# Altium schematic sheet blackbox_sch.SchDoc
size A3; Organization: Altium Limited; Address1: L3, 12a Rodborough Rd; Address2: Frenchs Forest; Address3: NSW; Address4: Australia 2086; SheetNumber: 1; SheetTotal: 4
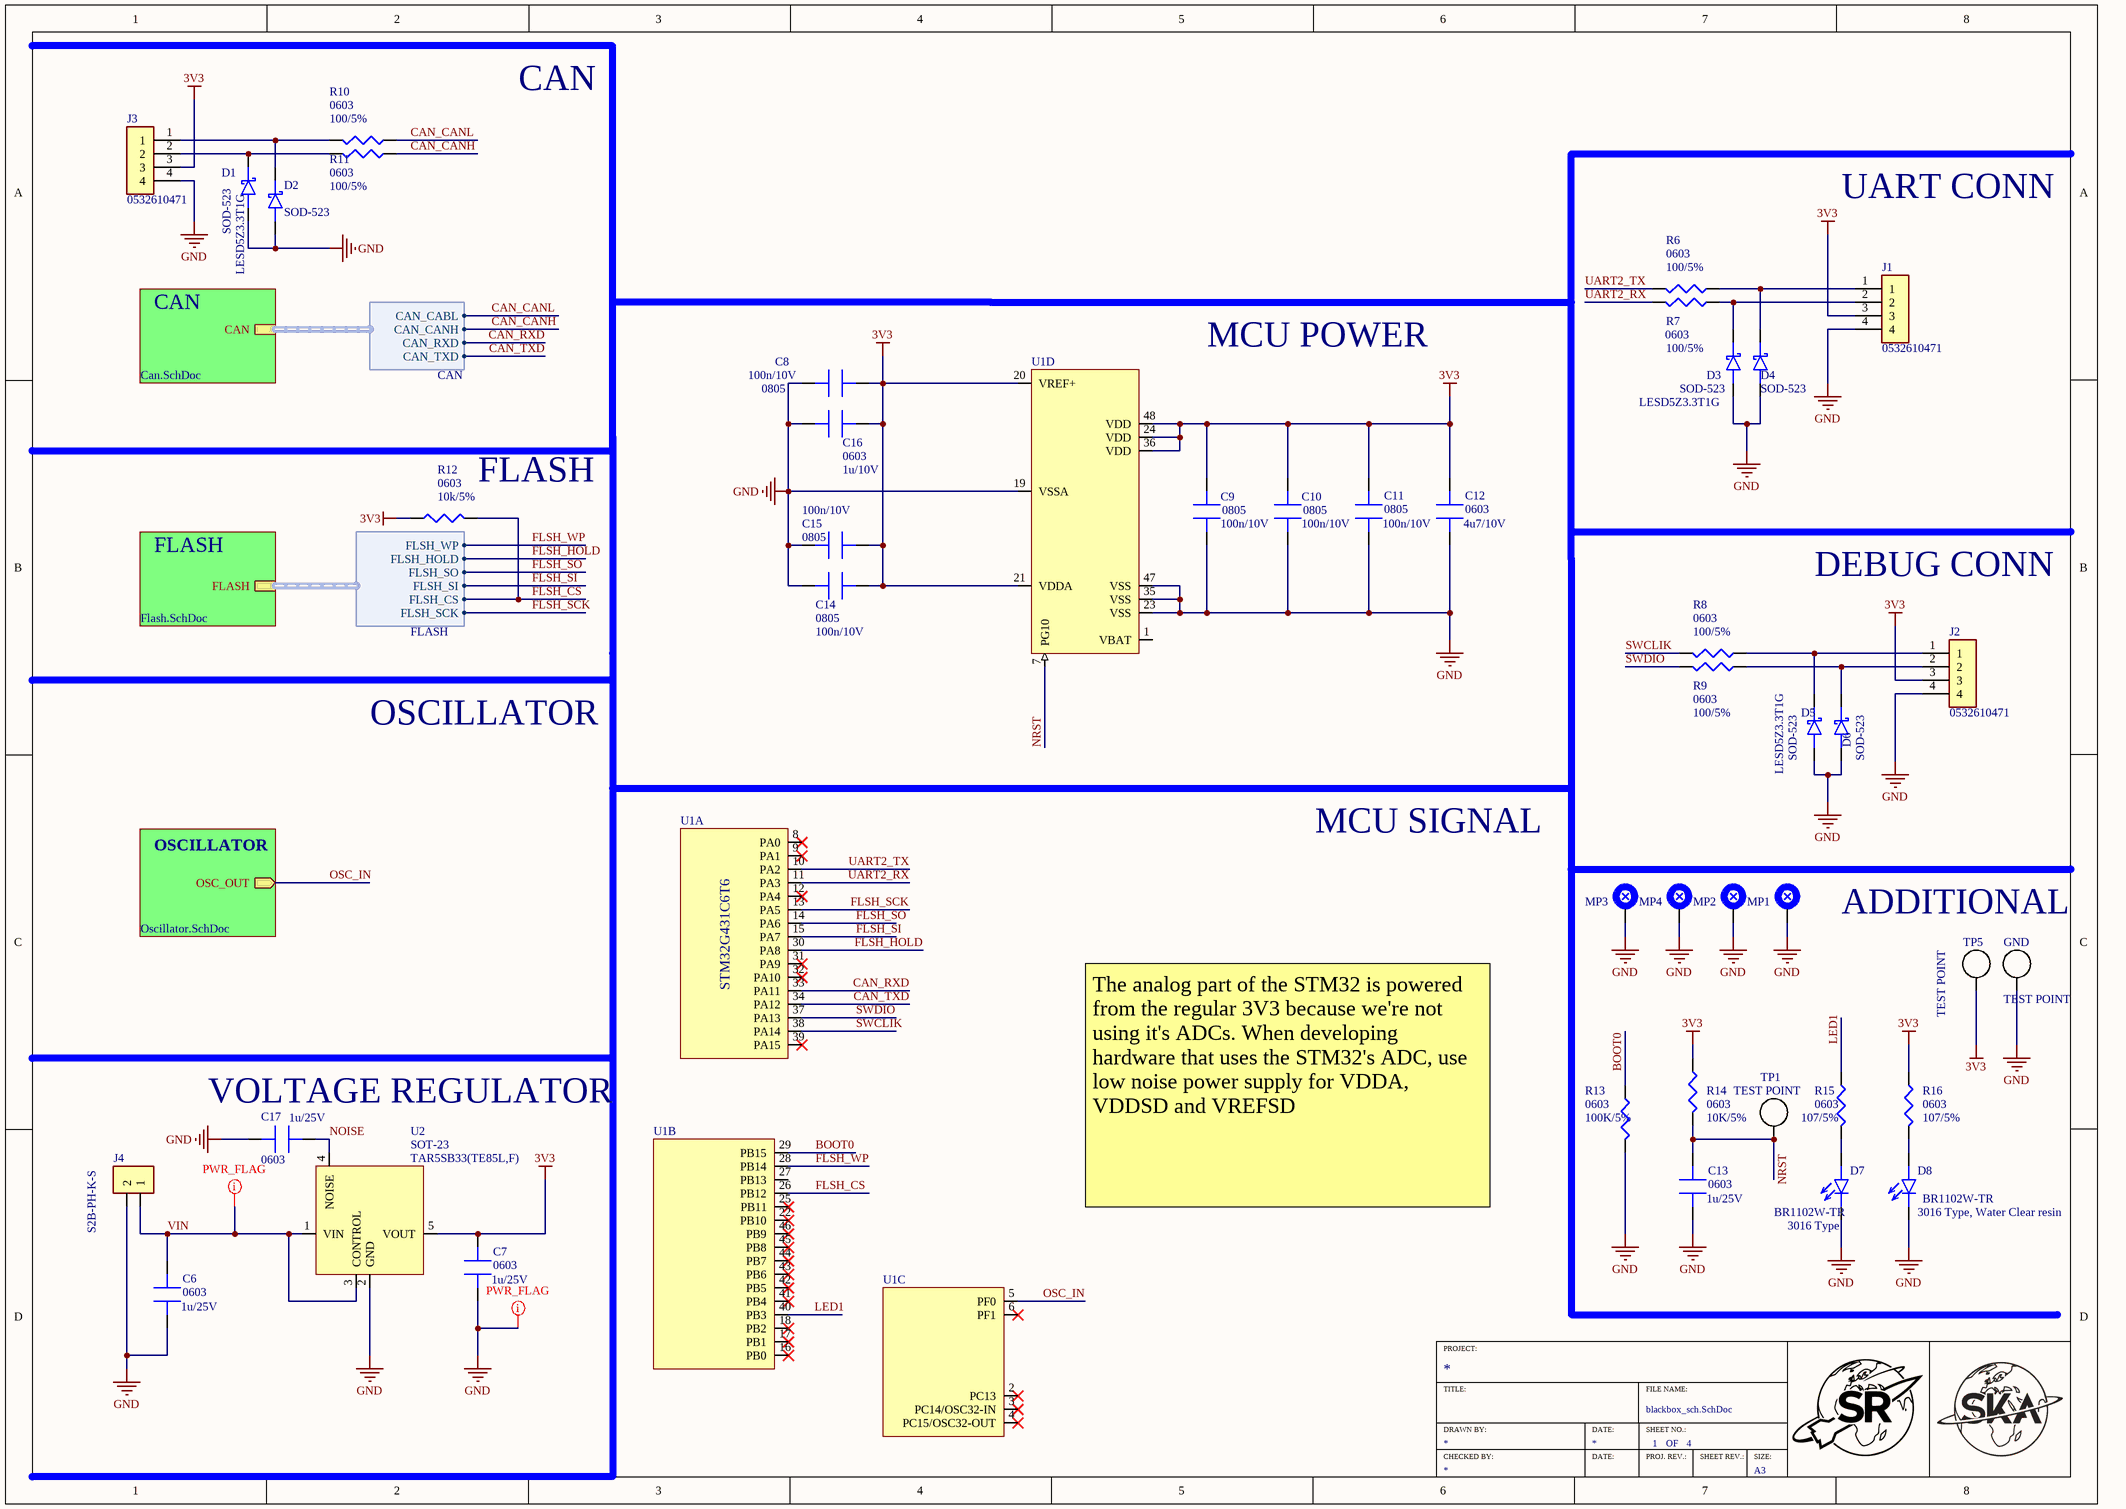
[diagram p0: blackbox_sch.SchDoc]

## Parts
C6  value 1u/25V  Package: 0603  [CAPC1608X10L [0603]]  (hidden comment: C)
C7  value 1u/25V  Package: 0603  [CAPC1608X10L [0603]]  (hidden comment: C)
C8  value 100n/10V  Package: 0805  [CAPC2012X09L [0805]]  (hidden comment: C)
C9  value 100n/10V  Package: 0805  [CAPC2012X09L [0805]]  (hidden comment: C)
C10  value 100n/10V  Package: 0805  [CAPC2012X09L [0805]]  (hidden comment: C)
C11  value 100n/10V  Package: 0805  [CAPC2012X09L [0805]]  (hidden comment: C)
C12  value 4u7/10V  Package: 0603  [CAPC1608X10L [0603]]  (hidden comment: C)
C13  value 1u/25V  Package: 0603  [CAPC1608X10L [0603]]  (hidden comment: C)
C14  value 100n/10V  Package: 0805  [CAPC2012X09L [0805]]  (hidden comment: C)
C15  value 100n/10V  Package: 0805  [CAPC2012X09L [0805]]  (hidden comment: C)
C16  value 1u/10V  Package: 0603  [CAPC1608X10L [0603]]  (hidden comment: C)
C17  value 1u/25V  Package: 0603  [CAPC1608X10L [0603]]  (hidden comment: C)
D1  LESD5Z3.3T1G  Package: SOD-523  [sSchottky]
D2  Package: SOD-523  [sSchottky]  (hidden comment: LESD5Z3.3T1G)
D3  LESD5Z3.3T1G  Package: SOD-523  [sSchottky]
D4  Package: SOD-523  [sSchottky]  (hidden comment: LESD5Z3.3T1G)
D5  LESD5Z3.3T1G  Package: SOD-523  [sSchottky]
D6  Package: SOD-523  [sSchottky]  (hidden comment: LESD5Z3.3T1G)
D7  BR1102W-TR  Package: 3016 Type  [SODFL160X130-2N]
D8  Package: 3016 Type, Water Clear resin  [SODFL160X130-2N]  (hidden comment: BR1102W-TR)
GND  TEST POINT  [TEST POINT]
J1  0532610471  [MOLEX_0532610471]
J2  0532610471  [MOLEX_0532610471]
J3  0532610471  [MOLEX_0532610471]
J4  PN: S2B-PH-K-S  [JST_PH_S2B-PH-K-S]  (hidden comment: JST_PH_S2B-PH-K-S)
MP1  Mounting hole  [Mounting_hole_M3]  (value not drawn)
MP2  Mounting hole  [Mounting_hole_M3]  (value not drawn)
MP3  Mounting hole  [Mounting_hole_M3]  (value not drawn)
MP4  Mounting hole  [Mounting_hole_M3]  (value not drawn)
R6  value 100/5%  Package: 0603  [RESC1608X05L [0603]]  (hidden comment: R)
R7  value 100/5%  Package: 0603  [RESC1608X05L [0603]]  (hidden comment: R)
R8  value 100/5%  Package: 0603  [RESC1608X05L [0603]]  (hidden comment: R)
R9  value 100/5%  Package: 0603  [RESC1608X05L [0603]]  (hidden comment: R)
R10  value 100/5%  Package: 0603  [RESC1608X05L [0603]]  (hidden comment: R)
R11  value 100/5%  Package: 0603  [RESC1608X05L [0603]]  (hidden comment: R)
R12  value 10k/5%  Package: 0603  [RESC1608X05L [0603]]  (hidden comment: R)
R13  value 100K/5%  Package: 0603  [RESC1608X05L [0603]]  (hidden comment: R)
R14  value 10K/5%  Package: 0603  [RESC1608X05L [0603]]  (hidden comment: R)
R15  value 107/5%  Package: 0603  [RESC1608X05L [0603]]  (hidden comment: R)
R16  value 107/5%  Package: 0603  [RESC1608X05L [0603]]  (hidden comment: R)
TP1  TEST POINT  [TEST POINT]
TP5  TEST POINT  [TEST POINT]
U1  IC MCU 32BIT 32KB FLASH 48LQFP  [TSQFP50P900X900X160-48N]  (value not drawn)  (parts A,B,C,D of 4)
U2  Paclage: SOT-23  [SOT95P275X140-5N]  (hidden comment: LDO Voltage Regulators)

## Sub-sheets
CAN = Can.SchDoc: CAN (harness CAN)
FLASH = Flash.SchDoc: FLASH (harness FLASH)
OSCILLATOR = Oscillator.SchDoc: OSC_OUT (out)

## Harnesses
FLASH: FLSH_SCK, FLSH_CS, FLSH_SI, FLSH_SO, FLSH_HOLD, FLSH_WP
CAN: CAN_TXD, CAN_RXD, CAN_CANH, CAN_CABL

## Nets
3V3: C7.2 C8.2 C9.2 C10.2 C11.2 C12.2 C14.1 C15.1 C16.2 J1.3 J2.3 J3.3 R12.2 R14.2 R16.2 TP5.1 U1.20(VREF+) U1.21(VDDA) U1.24(VDD) U1.36(VDD) U1.48(VDD) U2.5(VOUT)
GND: C6.1 C7.1 C8.1 C9.1 C10.1 C11.1 C12.1 C13.1 C14.2 C15.2 C16.1 C17.1 D1.2 D2.2 D3.2 D4.2 D5.2 D6.2 D7.1 D8.1 GND.1 J1.4 J2.4 J3.4 J4.2 MP1.1 MP2.1 MP3.1 MP4.1 R13.1 U1.19(VSSA) U1.23(VSS) U1.35(VSS) U1.47(VSS) U2.2(GND)
BOOT0: R13.2 U1.29(PB15)
CAN_CANH: R11.2 ; sheet CAN/CAN.CAN_CANH
CAN_CANL: R10.2 ; sheet CAN/CAN.CAN_CABL
CAN_RXD: U1.33(PA11) ; sheet CAN/CAN.CAN_RXD
CAN_TXD: U1.34(PA12) ; sheet CAN/CAN.CAN_TXD
FLSH_CS: R12.1 U1.26(PB12) ; sheet FLASH/FLASH.FLSH_CS
FLSH_HOLD: U1.30(PA8) ; sheet FLASH/FLASH.FLSH_HOLD
FLSH_SCK: U1.13(PA5) ; sheet FLASH/FLASH.FLSH_SCK
FLSH_SI: U1.15(PA7) ; sheet FLASH/FLASH.FLSH_SI
FLSH_SO: U1.14(PA6) ; sheet FLASH/FLASH.FLSH_SO
FLSH_WP: U1.28(PB14) ; sheet FLASH/FLASH.FLSH_WP
LED1: R15.2 U1.40(PB3)
NOISE: C17.2 U2.4(NOISE)
NRST: C13.2 R14.1 TP1.1 U1.7(PG10)
OSC_IN: U1.5(PF0) ; sheet OSCILLATOR/OSC_OUT
SWCLIK: R8.1 U1.38(PA14)
SWDIO: R9.1 U1.37(PA13)
UART2_RX: R7.1 U1.11(PA3)
UART2_TX: R6.1 U1.10(PA2)
VIN: C6.2 J4.1 U2.1(VIN) U2.3(CONTROL)
NetD1_1: D1.1 J3.2 R11.1
NetD2_1: D2.1 J3.1 R10.1
NetD3_1: D3.1 J1.2 R7.2
NetD4_1: D4.1 J1.1 R6.2
NetD5_1: D5.1 J2.1 R8.2
NetD6_1: D6.1 J2.2 R9.2
NetD7_2: D7.2 R15.1
NetD8_2: D8.2 R16.1

Not connected (* = marked no-connect by the designer): U1 1(VBAT) 2(PC13)* 3(PC14/OSC32-IN)* 4(PC15/OSC32-OUT)* 6(PF1)* 8(PA0)* 9(PA1)* 12(PA4)* 16(PB0)* 17(PB1)* 18(PB2)* 22(PB10)* 25(PB11)* 27(PB13) 31(PA9)* 32(PA10)* 39(PA15)* 41(PB4)* 42(PB5)* 43(PB6)* 44(PB7)* 45(PB8)* 46(PB9)*

## Layout directives
Electrical type: Power output; net class PWR_FLAG: GND, VIN

## Notes on the sheet
- CAN
- UART CONN
- MCU POWER
- (near R12) FLASH
- DEBUG CONN
- OSCILLATOR
- MCU SIGNAL
- ADDITIONAL
- (near C17) VOLTAGE REGULATOR
- The analog part of the STM32 is powered from the regular 3V3 because we're not using it's ADCs. When developing hardware that uses the STM32's ADC, use low noise power supply for VDDA, VDDSD and VREFSD
- TITLE:
- PROJECT:
- FILE NAME:
- DRAWN BY:
- CHECKED BY:
- DATE:
- SHEET NO.:
- PROJ. REV.:
- OF
- SHEET REV.:
- SIZE:
- A3

## Library data of the parts
C6-C17 = C: Standard capacitor
D1-D6 = sSchottky: Stand−off Voltage:  2.5 V −12 V / Peak Power up to 200
D7 D8 = sLED: Standard LEDs - SMD Surface Mount LED; Supplier 1: Arrow Electronics; Supplier Part Number 1: BR1102W-TR
J1-J3 = MOLEX_PicoBlade: Connector Header Surface Mount, Right Angle 4 position 0.049" (1.25mm); Package: Tape & Reel (TR); HelpUrl: https://www.digikey.com/en/products/detail/molex/0532610471/699096
J4 = JST_PH_S2B-PH-K-S: JST 2-pin connector, male, horizontal, pitch 2.00mm; HelpURL: https://www.tme.eu/Document/bde47a97a79ef7b2143e7f603cd40725/PH.pdf
R6-R16 = R: Standard resistor
U1 = STM32G431C6T6: ARM® Cortex®-M4F series Microcontroller IC 32-Bit Single-Core 170MHz 32KB (32K x 8) FLASH 48-LQFP (7x7)
U2 = TAR5SB33(TE85L,F): LDO Voltage Regulators Point Reg SGL output 200mA 15V 3.3Vout; HelpURL: https://eu.mouser.com/datasheet/2/408/TAR5SB18_datasheet_en_20140301-1627700.pdf; Supplier part number: TAR5SB33(TE85L,F)